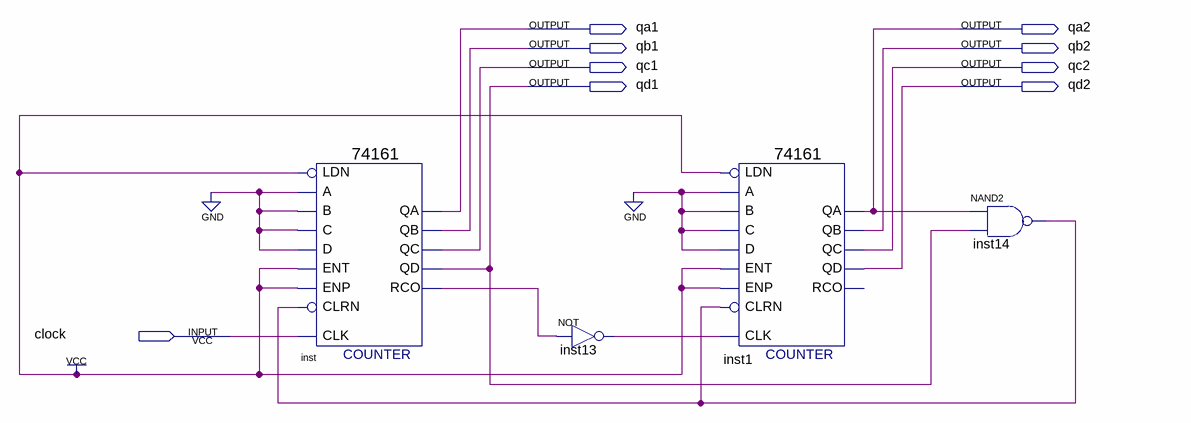
[diagram p0: schematic sheet]
// Quartus schematic mytest6.bdf as structural Verilog: 4 symbols, 9 pins
module mytest6 (
  input  clock,
  output qa1,
  output qa2,
  output qb1,
  output qb2,
  output qc1,
  output qc2,
  output qd1,
  output qd2
);

  wire inst13_out, inst14_out, inst_rco;

  \74161  inst (
    .CLRN(inst14_out), .CLK(clock), .ENP(1'b1), .LDN(1'b1), .A(1'b0), .D(1'b0), .ENT(1'b1), .B(1'b0),
    .C(1'b0), .QD(qd1), .QC(qc1), .QB(qb1), .QA(qa1), .RCO(inst_rco));
  not inst13 (inst13_out, inst_rco);
  \74161  inst1 (
    .CLRN(inst14_out), .CLK(inst13_out), .ENP(1'b1), .LDN(1'b1), .A(1'b0), .D(1'b0), .ENT(1'b1), .B(1'b0),
    .C(1'b0), .QD(qd2), .QC(qc2), .QB(qb2), .QA(qa2));  // open: RCO
  nand inst14 (inst14_out, qa2, qd1);
endmodule
